# EAGLE schematic WS2801-Breakout-v11-panelized (EAGLE 5.11)
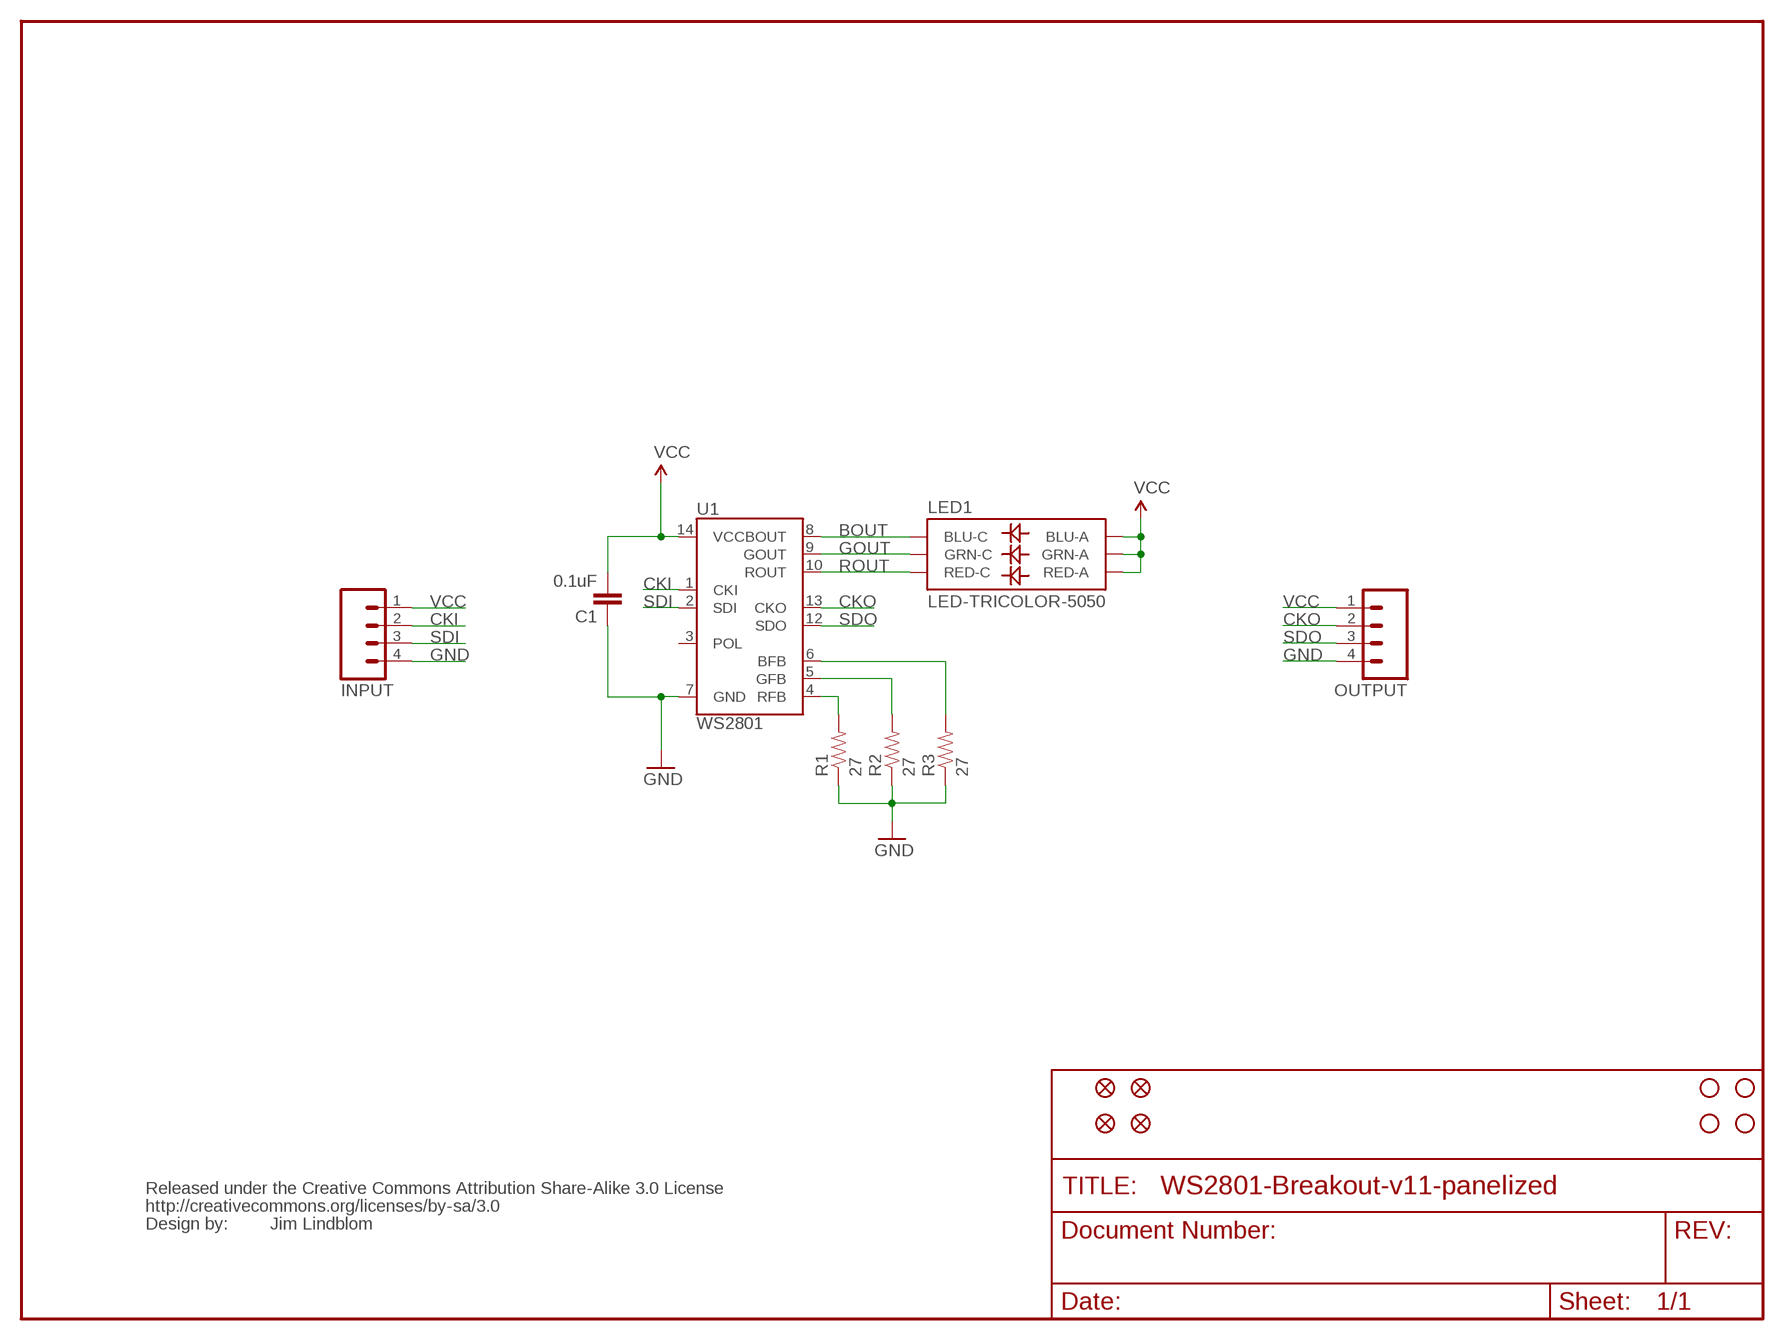
[diagram p0: schematic, sheet 1]

## Parts
C1  0.1uF  CAP0402-CAP  [0402-CAP]
INPUT  M04PTH  [1X04]
JP1  STAND-OFF  [STAND-OFF]
JP2  STAND-OFF  [STAND-OFF]
JP4  STAND-OFF  [STAND-OFF]
JP5  STAND-OFF  [STAND-OFF]
JP6  FIDUCIAL1X2  [FIDUCIAL-1X2]
JP7  FIDUCIAL1X2  [FIDUCIAL-1X2]
JP8  FIDUCIAL1X2  [FIDUCIAL-1X2]
JP9  FIDUCIAL1X2  [FIDUCIAL-1X2]
LED1  LED-TRICOLOR-5050  [LED-TRICOLOR-5050]
OUTPUT  M04PTH  [1X04]
R1  27  RESISTOR0402-RES  [0402-RES]
R2  27  RESISTOR0402-RES  [0402-RES]
R3  27  RESISTOR0402-RES  [0402-RES]
U1  WS2801  [SOP-14]
U$1  CREATIVE_COMMONS  [CREATIVE_COMMONS]

## Nets
BFB: R3.2 U1.6(BFB)
BOUT: LED1.4(BLU-C) U1.8(BOUT)
CKI: INPUT.2 U1.1(CKI)
CKO: OUTPUT.2 U1.13(CKO)
GFB: R2.2 U1.5(GFB)
GND: C1.1 INPUT.4 OUTPUT.4 R1.1 R2.1 R3.1 U1.7(GND)
GOUT: LED1.6(GRN-C) U1.9(GOUT)
RFB: R1.2 U1.4(RFB)
ROUT: LED1.5(RED-C) U1.10(ROUT)
SDI: INPUT.3 U1.2(SDI)
SDO: OUTPUT.3 U1.12(SDO)
VCC: C1.2 INPUT.1 LED1.1(GRN-A) LED1.2(RED-A) LED1.3(BLU-A) OUTPUT.1 U1.14(VCC)
Unconnected: U1.3(POL)

## Notes on the sheet
- Jim Lindblom

## Library data of the parts
C1 = SparkFun:CAP: Capacitor Standard 0603 ceramic capacitor, and 0.1" leaded capacitor.
INPUT OUTPUT = SparkFun:M04: Header 4 Standard 4-pin 0.1" header. Use with straight break away headers (SKU : PRT-00116), right angle break away headers (PRT-00553), swiss pins (PRT-00743), machine pins (PRT-00117), and female headers (PRT-00115). Molex polarized connector foot print use with SKU : PRT-08231 with associated crimp pins and housings. 1MM SMD Version SKU: PRT-10208
JP1 JP2 JP4 JP5 = SparkFun:STAND-OFF: Stand Off This is the mechanical footprint for a #4 phillips button head screw. Use the keepout ring to avoid running the screw head into surrounding components. SKU : PRT-00447
JP6-JP9 = SparkFun:FIDUCIAL: Fiducial Alignment Points Various fiducial points for machine vision alignment.
LED1 = SparkFun:LED-TRICOLOR-5050
R1-R3 = SparkFun:RESISTOR: Resistor Basic schematic elements and footprints for 0603, 1206, and PTH resistors.
U1 = SparkFun:WS2801: WS2801 3 Channel Constant Current LED Driver with programmable PWM outputs. Datasheet: http://www.sparkfun.com/datasheets/Components/LED/WS2801.pdf
U$1 = SparkFun:CREATIVE_COMMONS